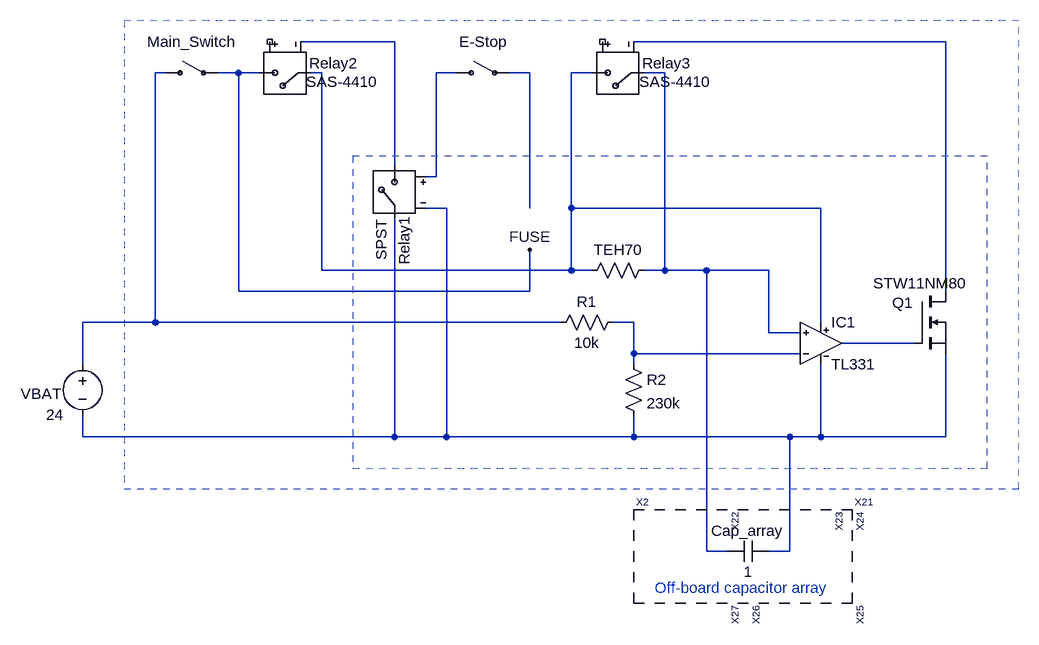
[diagram p0: schematic RTx_Charger_Alternative.asc]
RTx_Charger_Alternative.asc, the LTspice schematic file:
Version 4
SHEET 1 1356 788
WIRE -160 -272 -304 -272
WIRE 688 -272 208 -272
WIRE -512 -224 -528 -224
WIRE -400 -224 -432 -224
WIRE -368 -224 -400 -224
WIRE -272 -224 -288 -224
WIRE -64 -224 -96 -224
WIRE 48 -224 16 -224
WIRE 144 -224 112 -224
WIRE 256 -224 224 -224
WIRE -160 -80 -160 -272
WIRE -96 -64 -96 -224
WIRE -96 -64 -112 -64
WIRE -80 -16 -112 -16
WIRE 48 -16 48 -224
WIRE 112 -16 112 -224
WIRE 496 -16 112 -16
WIRE -272 80 -272 -224
WIRE 112 80 112 -16
WIRE 112 80 -272 80
WIRE 144 80 112 80
WIRE 256 80 256 -224
WIRE 256 80 224 80
WIRE 320 80 256 80
WIRE 416 80 320 80
WIRE -400 112 -400 -224
WIRE 48 112 48 48
WIRE 48 112 -400 112
WIRE 688 112 688 -272
WIRE -528 160 -528 -224
WIRE -528 160 -640 160
WIRE 96 160 -528 160
WIRE 208 160 176 160
WIRE 496 160 496 -16
WIRE 416 176 416 80
WIRE 464 176 416 176
WIRE 640 192 528 192
WIRE 208 208 208 160
WIRE 464 208 208 208
WIRE -640 224 -640 160
WIRE 208 224 208 208
WIRE -640 336 -640 304
WIRE -160 336 -160 0
WIRE -160 336 -640 336
WIRE -80 336 -80 -16
WIRE -80 336 -160 336
WIRE 208 336 208 304
WIRE 208 336 -80 336
WIRE 448 336 208 336
WIRE 496 336 496 224
WIRE 496 336 448 336
WIRE 688 336 688 208
WIRE 688 336 496 336
WIRE 320 512 320 80
WIRE 352 512 320 512
WIRE 448 512 448 336
WIRE 448 512 416 512
FLAG 48 48 FUSE
SYMBOL cap 352 528 R270
WINDOW 0 32 32 VTop 2
WINDOW 3 0 32 VBottom 2
SYMATTR InstName Cap_array
SYMATTR Value 1
SYMBOL voltage -640 208 R0
WINDOW 123 0 0 Left 2
WINDOW 39 0 0 Left 2
WINDOW 0 -95 62 Left 2
WINDOW 3 -56 94 Left 2
SYMATTR InstName VBAT
SYMATTR Value 24
SYMBOL res 128 96 R270
WINDOW 0 32 56 VTop 2
WINDOW 3 0 56 VBottom 2
SYMATTR InstName TEH70
SYMATTR Value ""
SYMBOL res 80 176 R270
WINDOW 0 32 56 VTop 2
WINDOW 3 0 56 VBottom 2
SYMATTR InstName R1
SYMATTR Value 10k
SYMBOL res 192 208 R0
SYMATTR InstName R2
SYMATTR Value 230k
SYMBOL nmos 640 112 R0
WINDOW 0 -2 18 Right 2
WINDOW 3 81 -12 Right 2
SYMATTR InstName Q1
SYMATTR Value STW11NM80
SYMBOL csw -512 -224 R270
WINDOW 0 32 40 VTop 2
WINDOW 3 -32 40 VBottom 2
SYMATTR InstName Main_Switch
SYMATTR Value ""
SYMBOL TL331 496 192 R0
SYMATTR InstName IC1
SYMBOL Relay2 192 -240 R180
WINDOW 0 -104 -1 Left 2
WINDOW 3 -134 -30 Left 2
SYMATTR InstName Relay3
SYMATTR Value SAS-4410
SYMBOL dashed_line2 208 528 R0
SYMATTR InstName X2
SYMBOL dashed_line2 544 528 R0
SYMATTR InstName X21
SYMBOL dashed_line2 272 448 R90
SYMATTR InstName X22
SYMBOL dashed_line2 432 448 R90
SYMATTR InstName X23
SYMBOL dashed_line2 464 448 R90
SYMATTR InstName X24
SYMBOL dashed_line2 464 592 R90
SYMATTR InstName X25
SYMBOL dashed_line2 304 592 R90
SYMATTR InstName X26
SYMBOL dashed_line2 272 592 R90
SYMATTR InstName X27
SYMBOL Relay2 -144 -32 R270
WINDOW 0 -104 -1 Left 2
WINDOW 3 -97 -36 Left 2
SYMATTR InstName Relay1
SYMBOL Relay2 -320 -240 R180
WINDOW 0 -104 -1 Left 2
WINDOW 3 -134 -30 Left 2
SYMATTR InstName Relay2
SYMATTR Value SAS-4410
SYMBOL csw -64 -224 R270
WINDOW 0 32 40 VTop 2
WINDOW 3 -32 40 VBottom 2
SYMATTR InstName E-Stop
SYMATTR Value ""
TEXT 240 568 Left 2 ;Off-board capacitor array
LINE Normal 752 384 752 -96 1
LINE Normal -224 384 752 384 1
LINE Normal -224 -96 -224 384 1
LINE Normal 752 -96 -224 -96 1
LINE Normal 800 -304 -576 -304 1
LINE Normal 800 416 800 -304 1
LINE Normal -576 416 800 416 1
LINE Normal -576 -304 -576 416 1

The netlist it stands for:
* RTx_Charger_Alternative.asc
Cap_array N007 N008 1
VBAT N003 N008 24
R§TEH70 N004 N007
R1 N003 N009 10k
R2 N009 N008 230k
M§Q1 N002 N010 N008 N008 STW11NM80
W§Main_Switch N003 FUSE
XIC1 N009 N007 N004 N008 N010 LT1018  ; pins In+ In- V+ V- OUT
S§Relay3 N007 N004 NC_01 N002 SAS-4410
XX2 dashed_line2
XX21 dashed_line2
XX22 dashed_line2
XX23 dashed_line2
XX24 dashed_line2
XX25 dashed_line2
XX26 dashed_line2
XX27 dashed_line2
S§Relay1 N008 N001 N005 N008 SPST
S§Relay2 N004 FUSE NC_02 N001 SAS-4410
W§E-Stop N005 N006
.model NMOS NMOS
.model PMOS PMOS
.lib standard.mos
* Off-board capacitor array
.lib LTC1.lib
.backanno
.end